# Altium schematic sheet Main.SchDoc
size A3; Date: AUG 25; Engineer: NH; SheetNumber: 1; SheetTotal: 4
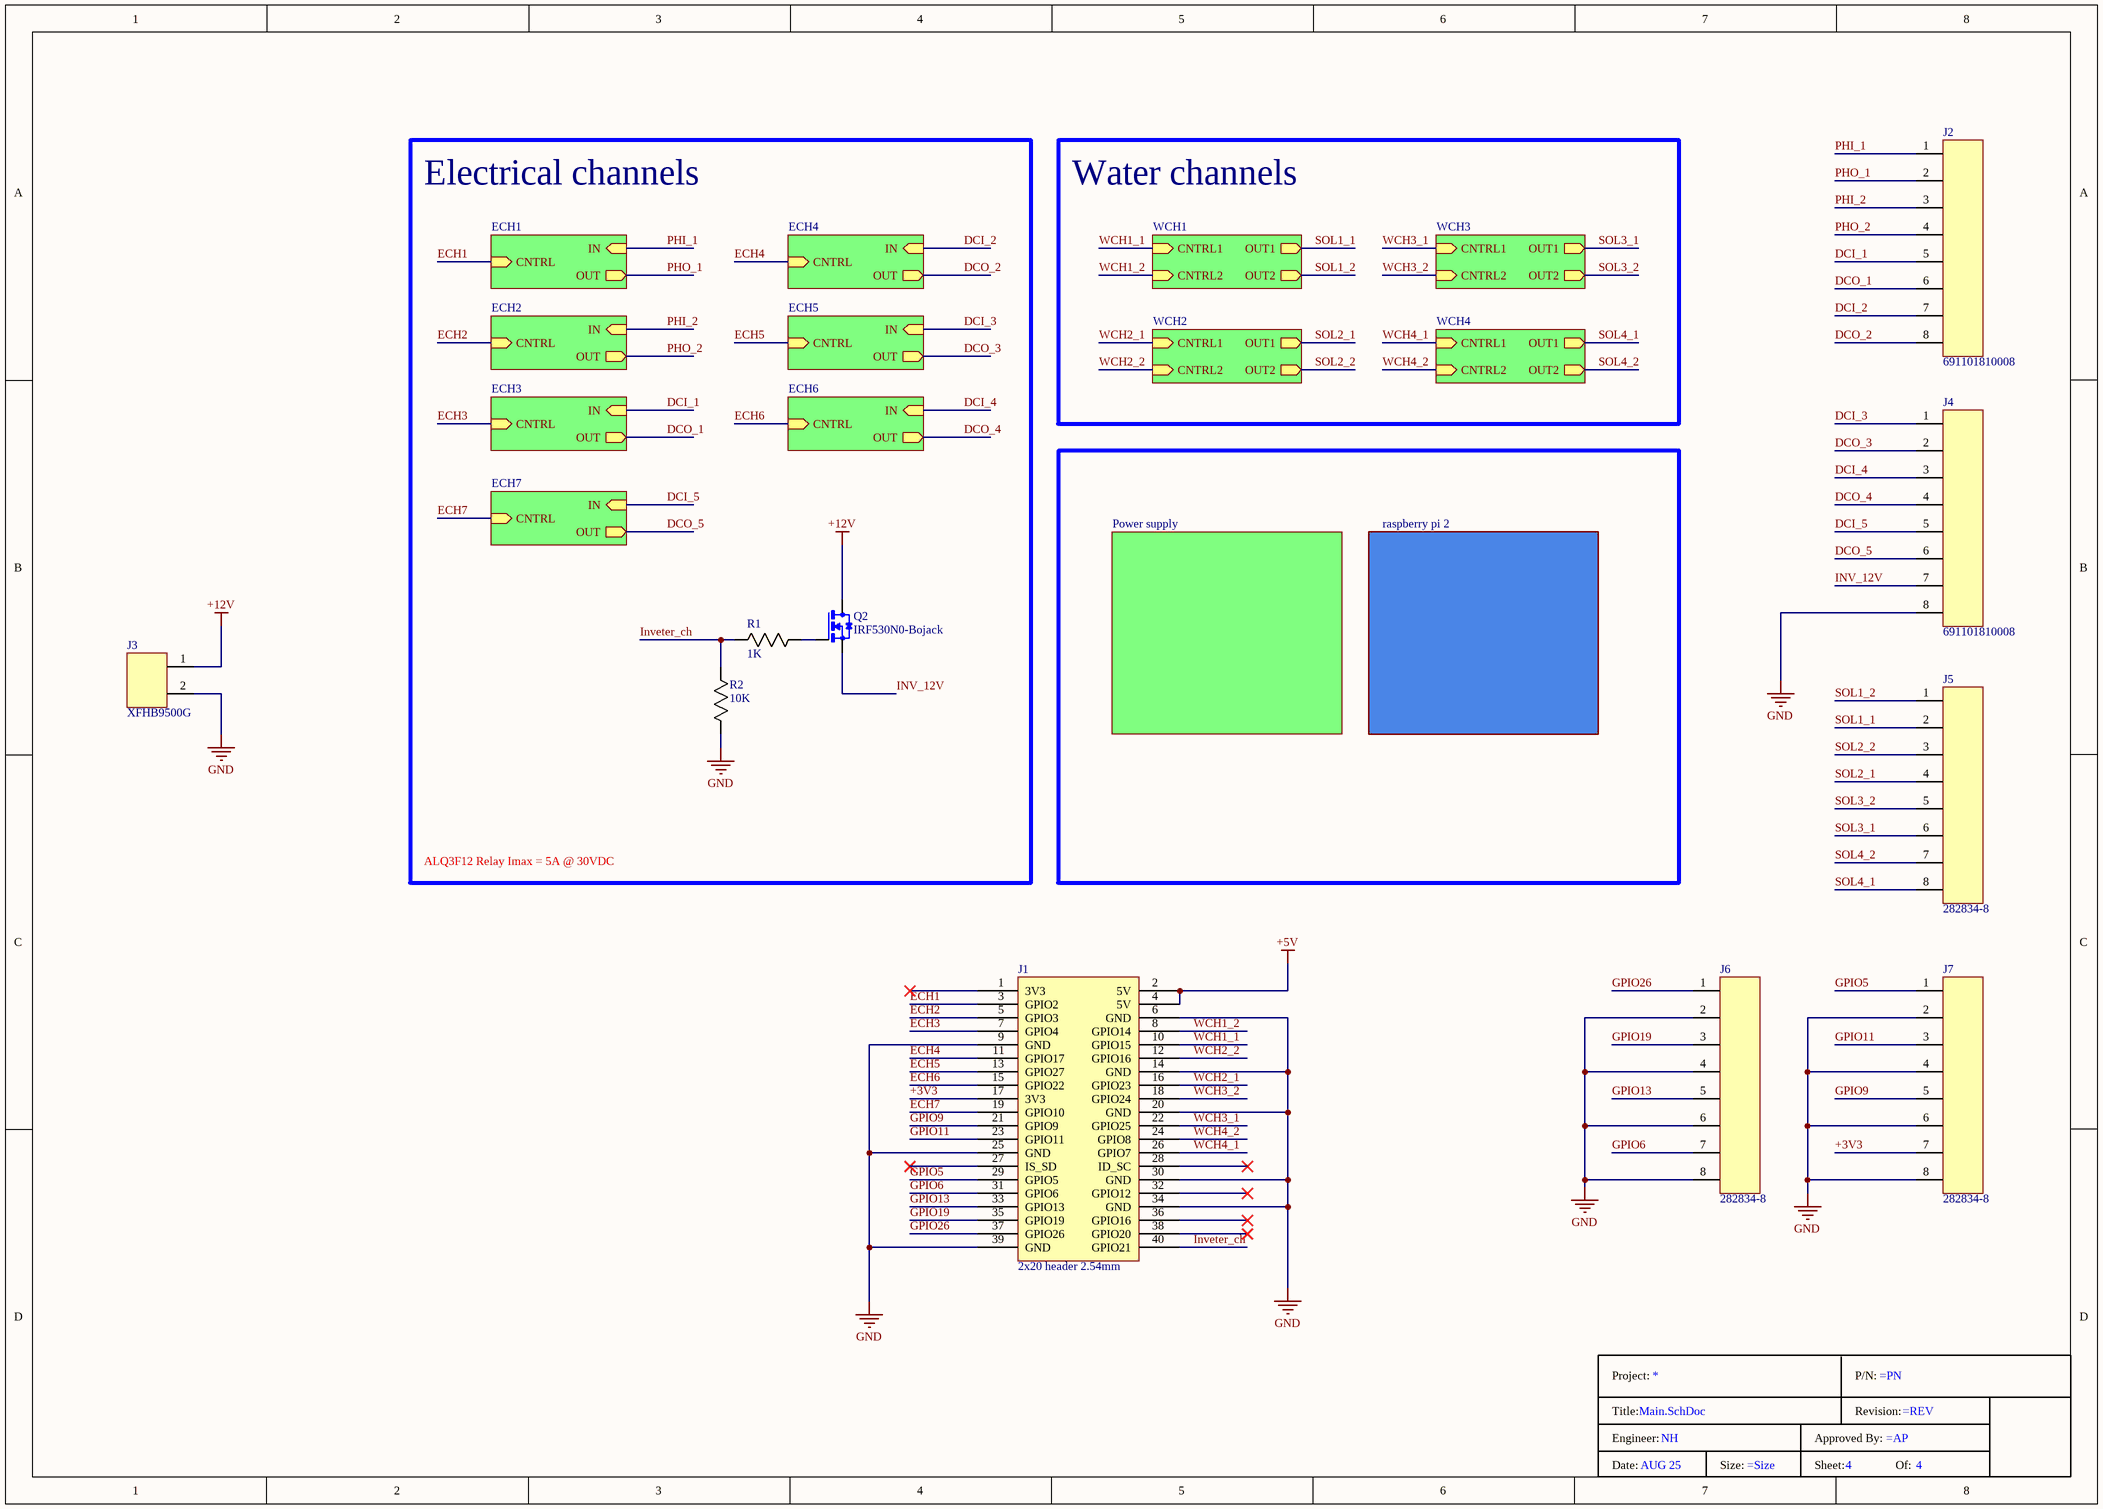
[diagram p0: Main.SchDoc]

## Parts
*  Title Block  (value not drawn)  (graphical)
J1  2x20 header 2.54mm  [2x20 2.54mm header]
J2  691101810008  [691101810008]
J3  XFHB9500G  [XHFB9500G]
J4  691101810008  [691101810008]
J5  282834-8  [282834-8]
J6  282834-8  [282834-8]
J7  282834-8  [282834-8]
Q2  IRF530N0-Bojack  [SOT78(TO220AB)]
R1  1K  [R0603]
R2  10K  [R0603]
U3  raspberry pi 2  [Raspberry pi 2]  (mechanical)

## Blocks framed on the sheet
Electrical channels: Q2 R1 R2

## Sub-sheets
ECH1 = Electrical Channels.SchDoc: CNTRL (in), IN (in), OUT (out)
ECH2 = Electrical Channels.SchDoc: CNTRL (in), IN (in), OUT (out)
ECH3 = Electrical Channels.SchDoc: CNTRL (in), IN (in), OUT (out)
ECH4 = Electrical Channels.SchDoc: CNTRL (in), IN (in), OUT (out)
ECH5 = Electrical Channels.SchDoc: CNTRL (in), IN (in), OUT (out)
ECH6 = Electrical Channels.SchDoc: CNTRL (in), IN (in), OUT (out)
ECH7 = Electrical Channels.SchDoc: CNTRL (in), IN (in), OUT (out)
Power supply = PS.SchDoc: no entries
WCH1 = Water Channel.SchDoc: CNTRL1 (in), CNTRL2 (in), OUT1 (out), OUT2 (out)
WCH2 = Water Channel.SchDoc: CNTRL1 (in), CNTRL2 (in), OUT1 (out), OUT2 (out)
WCH3 = Water Channel.SchDoc: CNTRL1 (in), CNTRL2 (in), OUT1 (out), OUT2 (out)
WCH4 = Water Channel.SchDoc: CNTRL1 (in), CNTRL2 (in), OUT1 (out), OUT2 (out)

## Nets
+5V: J1.2(5V) J1.4(5V)
+12V: J3.1 Q2.3(D)
GND: J1.6(GND) J1.9(GND) J1.14(GND) J1.20(GND) J1.25(GND) J1.30(GND) J1.34(GND) J1.39(GND) J3.2 J4.8 J6.2 J6.4 J6.6 J6.8 J7.2 J7.4 J7.6 J7.8 R2.1
+3V3: J1.17(3V3) J7.7
DCI_1: J2.5 ; sheet ECH3/IN
DCI_2: J2.7 ; sheet ECH4/IN
DCI_3: J4.1 ; sheet ECH5/IN
DCI_4: J4.3 ; sheet ECH6/IN
DCI_5: J4.5 ; sheet ECH7/IN
DCO_1: J2.6 ; sheet ECH3/OUT
DCO_2: J2.8 ; sheet ECH4/OUT
DCO_3: J4.2 ; sheet ECH5/OUT
DCO_4: J4.4 ; sheet ECH6/OUT
DCO_5: J4.6 ; sheet ECH7/OUT
ECH1: J1.3(GPIO2) ; sheet ECH1/CNTRL
ECH2: J1.5(GPIO3) ; sheet ECH2/CNTRL
ECH3: J1.7(GPIO4) ; sheet ECH3/CNTRL
ECH4: J1.11(GPIO17) ; sheet ECH4/CNTRL
ECH5: J1.13(GPIO27) ; sheet ECH5/CNTRL
ECH6: J1.15(GPIO22) ; sheet ECH6/CNTRL
ECH7: J1.19(GPIO10) ; sheet ECH7/CNTRL
GPIO5: J1.29(GPIO5) J7.1
GPIO6: J1.31(GPIO6) J6.7
GPIO9: J1.21(GPIO9) J7.5
GPIO11: J1.23(GPIO11) J7.3
GPIO13: J1.33(GPIO13) J6.5
GPIO19: J1.35(GPIO19) J6.3
GPIO26: J1.37(GPIO26) J6.1
INV_12V: J4.7 Q2.2(S)
Inveter_ch: J1.40(GPIO21) R1.1 R2.2
PHI_1: J2.1 ; sheet ECH1/IN
PHI_2: J2.3 ; sheet ECH2/IN
PHO_1: J2.2 ; sheet ECH1/OUT
PHO_2: J2.4 ; sheet ECH2/OUT
SOL1_1: J5.2 ; sheet WCH1/OUT1
SOL1_2: J5.1 ; sheet WCH1/OUT2
SOL2_1: J5.4 ; sheet WCH2/OUT1
SOL2_2: J5.3 ; sheet WCH2/OUT2
SOL3_1: J5.6 ; sheet WCH3/OUT1
SOL3_2: J5.5 ; sheet WCH3/OUT2
SOL4_1: J5.8 ; sheet WCH4/OUT1
SOL4_2: J5.7 ; sheet WCH4/OUT2
WCH1_1: J1.10(GPIO15) ; sheet WCH1/CNTRL1
WCH1_2: J1.8(GPIO14) ; sheet WCH1/CNTRL2
WCH2_1: J1.16(GPIO23) ; sheet WCH2/CNTRL1
WCH2_2: J1.12(GPIO16) ; sheet WCH2/CNTRL2
WCH3_1: J1.22(GPIO25) ; sheet WCH3/CNTRL1
WCH3_2: J1.18(GPIO24) ; sheet WCH3/CNTRL2
WCH4_1: J1.26(GPIO7) ; sheet WCH4/CNTRL1
WCH4_2: J1.24(GPIO8) ; sheet WCH4/CNTRL2
NetQ2_1: Q2.1(G) R1.2

Not connected (* = marked no-connect by the designer): J1 1(3V3)* 27(IS_SD)* 28(ID_SC)* 32(GPIO12)* 36(GPIO16)* 38(GPIO20)*

## Notes on the sheet
- Water channels
- ALQ3F12 Relay Imax = 5A @ 30VDC
- (in symbol Title Block) Project:; P/N:; Title:; Revision:; Engineer:; Approved By:; Date:; Size:; Sheet:; Of:

## Library data of the parts
* = Title Block: Hatokay DSL&P Titile Block
J2 J4 = 691101810008: 8 Position Wire to Board Terminal Block Horizontal with Board 0.394" (10.00mm) Through Hole; Manufacturer: Würth Elektronik; Manufacturer P/N: 691101810008
J3 = XFHB9500G: Manufacturer: XF; Manufacturer P/N: XFHB9500G
J5-J7 = 282834-8: TERM BLK 8P SIDE ENT 2.54MM PCB; Manufacturer: TE Connectivity AMP Connectors; Manufacturer P/N: 282834-8
Q2 = IRF530N0-Bojack: MOSFET N-CH 100V 17A TO220AB; Manufacturer: Infineon Technologies; Manufacturer P/N: IRF530N0
R1 = RMCF0603FT1K00: Manufacturer: Stackpole Electronics Inc; Manufacturer P/N: RMCF0603FT1K00
R2 = RMCF0603FT10K0: Manufacturer: Stackpole Electronics Inc; Manufacturer P/N: RMCF0603FT10K0